# EAGLE design GaragentorSteuerung (EAGLE 9.2.2)
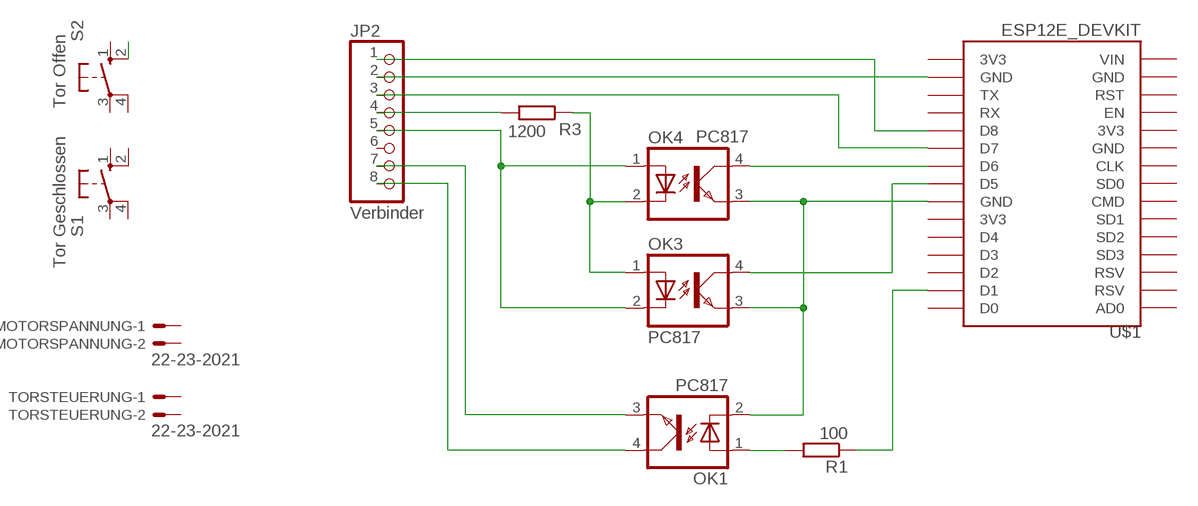
[diagram p0: schematic, sheet 1]

## Parts
JP2  Verbinder  PINHD-1X8  [1X08]
MOTORSPANNUNG  22-23-2021  [22-23-2021]
OK1  PC817  [DIL04]
OK3  PC817  [DIL04]
OK4  PC817  [DIL04]
R1  100  R-EU_0207/7  [0207/7]
R3  1200  R-EU_0207/7  [0207/7]
S1  Tor Geschlossen  10-XX  [B3F-10XX]
S2  Tor Offen  10-XX  [B3F-10XX]
TORSTEUERUNG  22-23-2021  [22-23-2021]
U$1  ESP12E_DEVKIT  [ESP12E_DEVKIT]

## Nets
N$1: JP2.1 U$1.D8
N$2: JP2.2 U$1.GND@3(GND)
N$3: OK1.1(A) R1.2
N$4: OK4.4(COL) U$1.D6
N$5: JP2.5 OK3.2(C) OK4.1(A)
N$6: OK3.1(A) OK4.2(C) R3.1
N$7: OK1.2(C) OK3.3(EMIT) OK4.3(EMIT) U$1.GND@2(GND)
N$8: OK3.4(COL) U$1.D5
N$9: R1.1 U$1.D1
N$11: JP2.7 OK1.3(EMIT)
N$12: JP2.8 OK1.4(COL)
N$13: JP2.4 R3.2
N$15: JP2.3 U$1.D7
N$16: S2.2(S1)
Unconnected: JP2.6 MOTORSPANNUNG.1 MOTORSPANNUNG.2 S1.1(S) S1.2(S1) S1.3(P) S1.4(P1) S2.1(S) S2.3(P) S2.4(P1) TORSTEUERUNG.1 TORSTEUERUNG.2 U$1.3V3@0(3V3) U$1.3V3@1(3V3) U$1.3V3@2(3V3) U$1.AD0 U$1.CLK U$1.CMD U$1.D0 U$1.D2 U$1.D3 U$1.D4 U$1.EN U$1.GND@0(GND) U$1.GND@1(GND) U$1.RST U$1.RSV@0(RSV) U$1.RSV@1(RSV) U$1.RX U$1.SD0 U$1.SD1 U$1.SD2 U$1.SD3 U$1.TX U$1.VIN

## Library data of the parts
JP2 = pinhead:PINHD-1X8: PIN HEADER
MOTORSPANNUNG TORSTEUERUNG = con-molex:22-23-2021: .100" (2.54mm) Center Header - 2 Pin; MF: MOLEX; MPN: 22-23-2021; OC_FARNELL: 1462926; OC_NEWARK: 25C3832
OK1 OK3 OK4 = optocoupler:PC817: SHARP OPTO COUPLER; MPN: PC817X4J000F; OC_FARNELL: 9707727; OC_NEWARK: 97K7059
R1 R3 = resistor:R-EU_: RESISTOR, European symbol
S1 S2 = switch-omron:10-XX: OMRON SWITCH; MPN: B3F-1000; OC_FARNELL: 176432; OC_NEWARK: 36M3542
U$1 = ESP12E_DEVKIT:ESP12E_DEVKIT: ESP12E DEVKIT BOARD

## Board
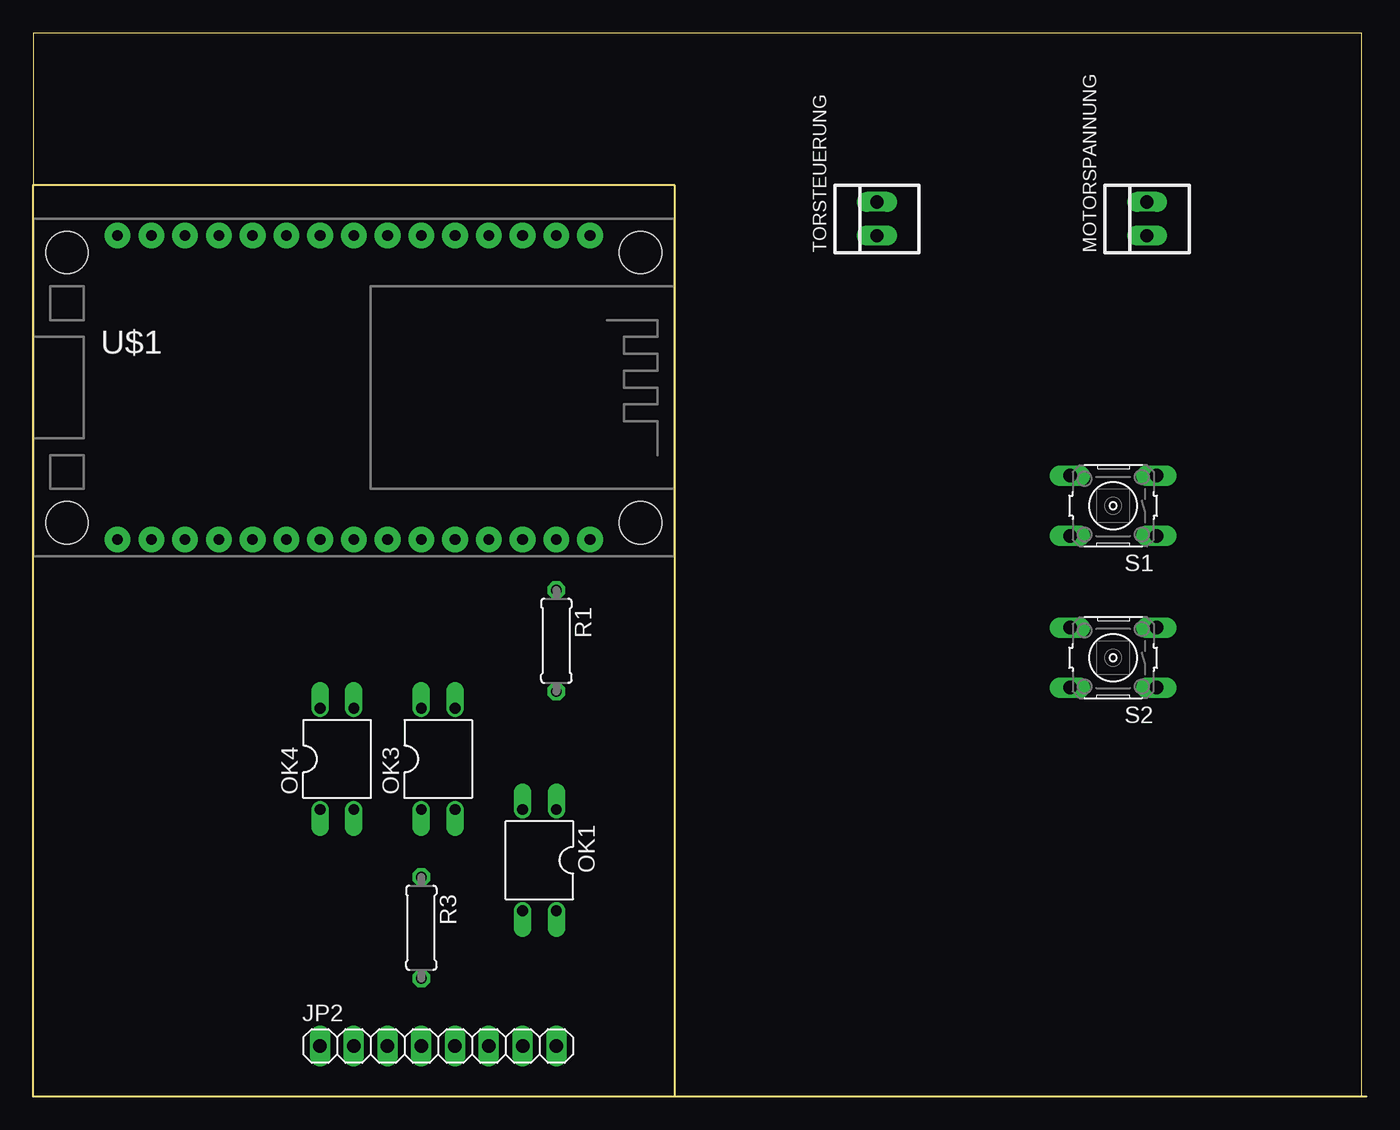
[diagram p1: board, top side]
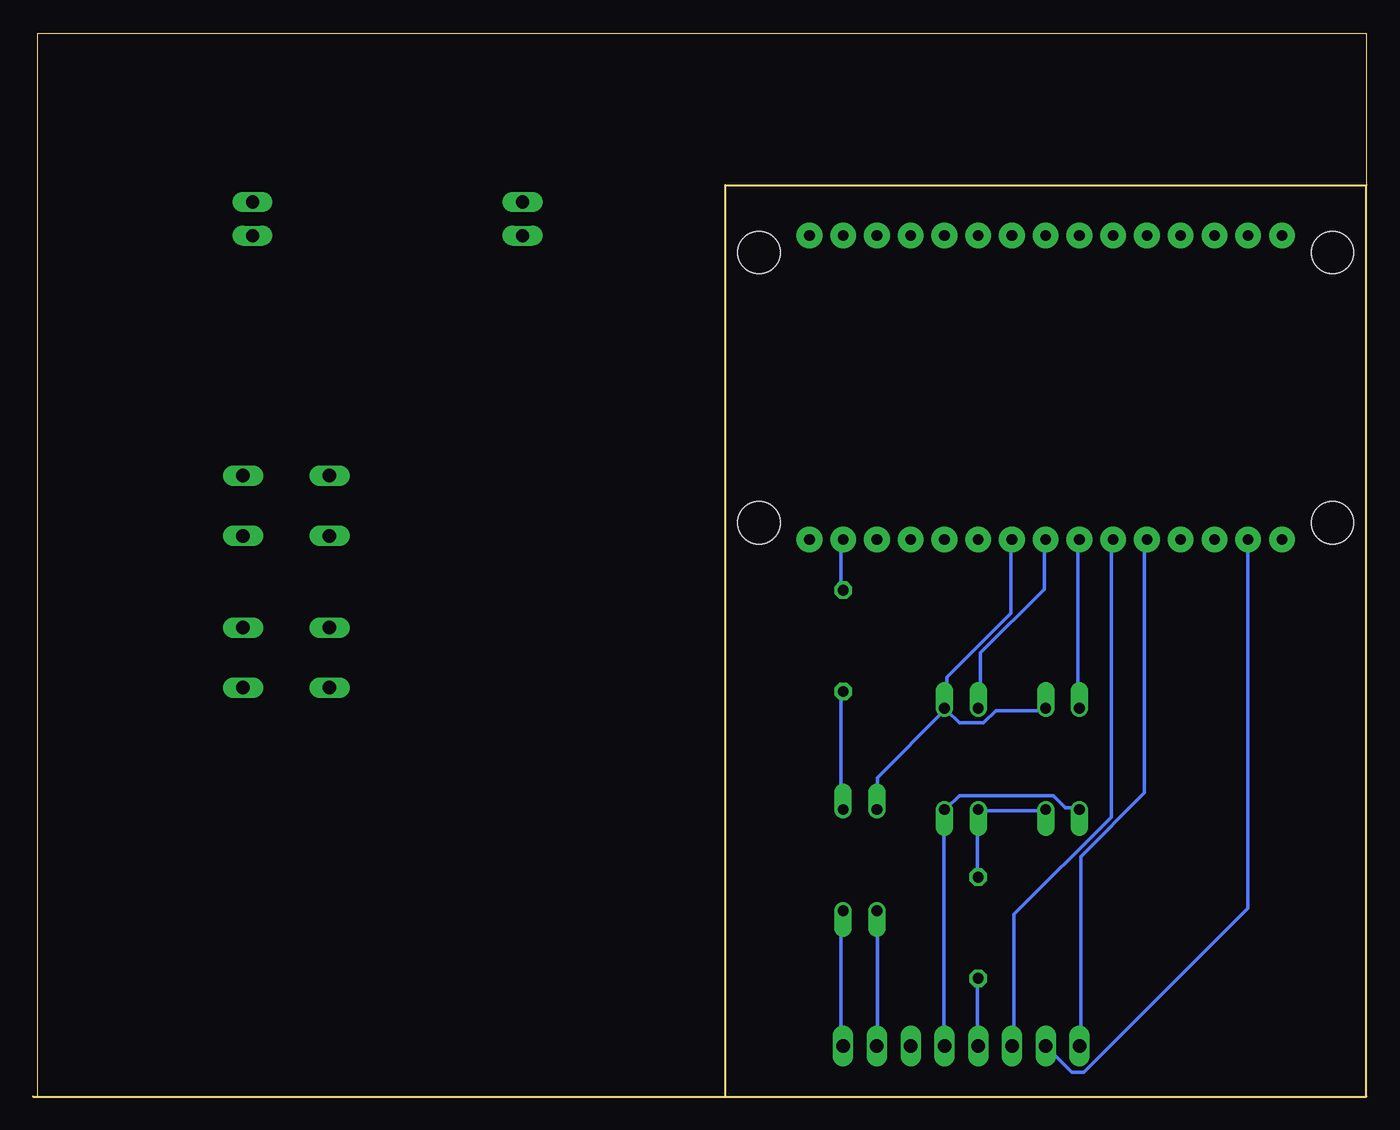
[diagram p2: board, bottom side, seen from below]

Size 100.33 x 80 mm. Coordinates in mm from the lower left corner, seen from the top.
Outline: 100,0 100,80 0,80 0,68.58
Outline: 0,68.58 48.26,68.58 48.26,0
Outline: 100.33,0 48.26,0
Outline: 48.26,0 0,0 0,68.58
Copper layers (1*16): Top 0.035mm / dielectric 1.5mm / Bottom 0.035mm
Design rules "default": minimum track width 10mil, minimum drill 24mil, track to track 8mil, track to pad 8mil, pad to pad 8mil, via to via 8mil, smd to smd 8mil, copper to edge 40mil, drill to drill 8mil, minimum pad ring 10mil, minimum via ring 8mil, stop-mask expansion 4mil, vias tented up to drill 0mil, thermal gap 10mil

### Footprints (pad centres in the part's own frame; a part is rotated, then mirrored left to right if it is on the bottom)
1X08 = drill 1.016 long: 1 -8.89,0; 2 -6.35,0; 3 -3.81,0; 4 -1.27,0; 5 1.27,0; 6 3.81,0; 7 6.35,0; 8 8.89,0
22-23-2021 = drill 1 long: 1 -1.27,0; 2 1.27,0
DIL04 = drill 0.813 offset: 1 -1.27,-3.81; 2 1.27,-3.81; 3 1.27,3.81; 4 -1.27,3.81
0207/7 = drill 0.813 octagon: 1 -3.81,0; 2 3.81,0
B3F-10XX = drill 1.016 long: 1 -3.251,2.261; 2 3.251,2.261; 3 -3.251,-2.261; 4 3.251,-2.261
ESP12E_DEVKIT = drill 0.8 pad 1.93: 3V3@0 -11.43,-7.62; 3V3@1 11.43,5.08; 3V3@2 11.43,-17.78; AD0 -11.43,17.78; CLK -11.43,-2.54; CMD -11.43,2.54; D0 11.43,17.78; D1 11.43,15.24; D2 11.43,12.7; D3 11.43,10.16; D4 11.43,7.62; D5 11.43,0; D6 11.43,-2.54; D7 11.43,-5.08; D8 11.43,-7.62; EN -11.43,-10.16; GND@0 -11.43,-5.08; GND@1 -11.43,-15.24; GND@2 11.43,2.54; GND@3 11.43,-15.24; RST -11.43,-12.7; RSV@0 -11.43,15.24; RSV@1 -11.43,12.7; RX 11.43,-10.16; SD0 -11.43,0; SD1 -11.43,5.08; SD2 -11.43,7.62; SD3 -11.43,10.16; TX 11.43,-12.7; VIN -11.43,-17.78 | hole 3.2: -10.16,21.59; 10.16,21.59; 10.16,-21.59; -10.16,-21.59

### Placement (x,y rotation side)
JP2  30.48,3.81 0 top
MOTORSPANNUNG  83.82,66.04 90 top
OK1  38.1,17.78 180 top
OK3  30.48,25.4 0 top
OK4  22.86,25.4 0 top
R1  39.37,34.29 270 top
R3  29.21,12.7 270 top
S1  81.28,44.45 180 top
S2  81.28,33.02 180 top
TORSTEUERUNG  63.5,66.04 90 top
U$1  24.13,53.34 270 top

### Tracks (layer width: path | path; a pad name or v marks a point on that pad's centre or on a via)
N$1
  Bottom 0.254: JP2.1 21.49,3.89 21.49,18.06 16.69,22.86 16.69,41.83 U$1.D8
N$2
  Bottom 0.254: JP2.2 24,3.66 22.17,1.83 21.26,1.83 8.91,14.17 8.91,41.83 U$1.GND@3
N$3
  Bottom 0.254: OK1.1 39.55,21.72 39.55,30.4 R1.2
N$4
  Bottom 0.254: OK4.4 21.72,29.26 21.72,41.83 U$1.D6
N$5
  Bottom 0.254: OK4.1 21.72,21.72 22.63,21.72 23.55,22.63 30.63,22.63 31.55,21.72 OK3.2 31.77,21.49 31.77,3.89 JP2.5
N$6
  Bottom 0.254: R3.1 29.26,16.69 29.26,21.49 OK3.1 29.03,21.49 24.23,21.49 OK4.2
N$7
  Bottom 0.254: OK1.2 36.8,21.72 36.8,24 31.77,29.03 OK3.3 | OK4.3 24.23,29.03 27.89,29.03 28.8,28.12 30.63,28.12 31.55,29.03 OK3.3 | U$1.GND@2 26.75,41.83 26.75,36.35 31.55,31.55 31.55,29.26 OK3.3
N$8
  Bottom 0.254: OK3.4 29.03,29.26 29.03,33.38 24.23,38.18 24.23,41.83 U$1.D5
N$9
  Bottom 0.254: R1.1 39.55,38.18 39.55,41.83 U$1.D1
N$11
  Bottom 0.254: OK1.3 36.8,13.95 36.8,3.89 JP2.7
N$12
  Bottom 0.254: OK1.4 39.55,13.95 39.55,3.89 JP2.8
N$13
  Bottom 0.254: R3.2 29.26,8.69 29.26,3.89 JP2.4
N$15
  Bottom 0.254: JP2.3 26.52,3.89 26.52,13.72 19.2,21.03 19.2,41.83 U$1.D7